# Altium schematic sheet IR Sensor FINAL.SchDoc
size A
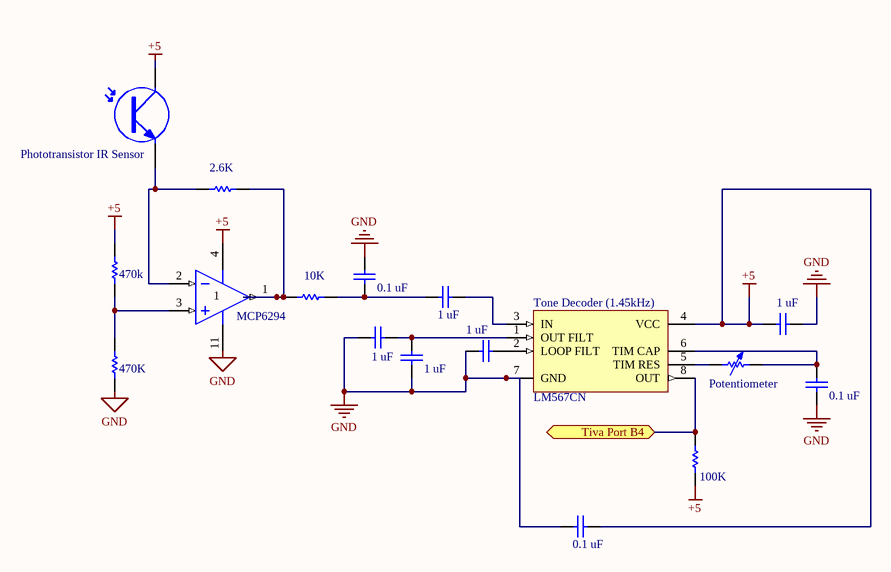
[diagram p0: IR Sensor FINAL.SchDoc]

## Parts
(Parts that share a designator on the sheet are numbered #1, #2 ... from top to bottom, then left to right.)
C?#1  value 0.1 uF  [RAD-0.3]  (hidden comment: Cap)
C?#2  value 1 uF  [RAD-0.3]  (hidden comment: Cap)
C?#3  value 1 uF  [RAD-0.3]  (hidden comment: Cap)
C?#4  value 1 uF  [RAD-0.3]  (hidden comment: Cap)
C?#5  value 1 uF  [RAD-0.3]  (hidden comment: Cap)
C?#6  value 1 uF  [RAD-0.3]  (hidden comment: Cap)
C?#7  value 0.1 uF  [RAD-0.3]  (hidden comment: Cap)
C?#8  value 0.1 uF  [RAD-0.3]  (hidden comment: Cap)
OpAmp  MCP6294  [DIP-14]  (part A of 4)
Phototransistor_IR_Sensor  LTR 3208  [SFM-T2(3)/X1.6V]  (value not drawn)
R?#1  2.6K  [AXIAL-0.3]
R?#2  470k  [AXIAL-0.3]
R?#3  value 10K  [AXIAL-0.3]  (hidden comment: Res1)
R?#4  470K  [AXIAL-0.3]
R?#5  Potentiometer  [AXIAL-0.7]
R?#6  value 100K  [AXIAL-0.3]  (hidden comment: Res1)
Tone_Decoder_(1.45kHz)  LM567CN  [DIP-8]

## Ports
Tiva Port B4

## Nets
+5: C?#5.2 C?#8.1 OpAmp.4(V+) Phototransistor_IR_Sensor.1(C) R?#2.1 R?#6.2 Tone_Decoder_(1.45kHz).4(VCC)
GND: C?#1.1 C?#3.1 C?#4.1 C?#5.1 C?#6.1 C?#7.1 C?#8.2 OpAmp.11(GND) R?#4.2 Tone_Decoder_(1.45kHz).7(GND)
Tiva Port B4: R?#6.1 Tone_Decoder_(1.45kHz).8(OUT) ; port Tiva Port B4
NetC?#1_2: C?#1.2 C?#2.2 R?#3.2
NetC?#2_1: C?#2.1 Tone_Decoder_(1.45kHz).3(IN)
NetC?#3_2: C?#3.2 C?#6.2 Tone_Decoder_(1.45kHz).1(OUT_FILT)
NetC?#4_2: C?#4.2 Tone_Decoder_(1.45kHz).2(LOOP_FILT)
NetC?#7_2: C?#7.2 R?#5.2 Tone_Decoder_(1.45kHz).6(TIM_CAP)
NetOpAmp_1: OpAmp.1(OUT) R?#1.2 R?#3.1
NetOpAmp_2: OpAmp.2(IN-) Phototransistor_IR_Sensor.3(E) R?#1.1
NetOpAmp_3: OpAmp.3(IN+) R?#2.2 R?#4.1
NetR?#5_1: R?#5.1 Tone_Decoder_(1.45kHz).5(TIM_RES)

## Library data of the parts
C?#1-C?#8 = Cap: Capacitor; Manufacturer: Generic Components; Class: Passive; Published: 08/06/2000; Publisher: Altium Hobart Technology Centre; SubClass: Capacitor
OpAmp = LM324AJ: Low-Power Quad Operational Amplifier; Manufacturer: National Semiconductor; Published: 15/04/2002; Publisher: Altium Hobart Technology Centre; Class: Amplifier; SubClass: Operational Amplifier
Phototransistor_IR_Sensor = Photo NPN: NPN Phototransistor; Manufacturer: Generic Components; Class: Optoelectronic; Published: 1999; Name: LTR 3208
R?#1-R?#4 R?#6 = Res1: Resistor; Manufacturer: Generic Components; Class: Passive; Published: 08/06/2000; Publisher: Altium Hobart Technology Centre; SubClass: Resistor
  R?#1: Value: 2.6K
  R?#2: Value: 470k
  R?#4: Value: 470K
R?#5 = Res Adj1: Variable Resistor; Manufacturer: Generic Components; Class: Passive; Set Position: 0.5; Value: 1K; Published: 08/06/2000; Publisher: Altium Hobart Technology Centre; SubClass: Resistor
Tone_Decoder_(1.45kHz) = LM567CN: Tone Decoder; Manufacturer: National Semiconductor; Class: Logic; SubClass: Decoder/Demultiplexer; Published: 15/04/2002; Publisher: Altium Hobart Technology Centre